# Altium schematic sheet Célula 1.SchDoc
size A
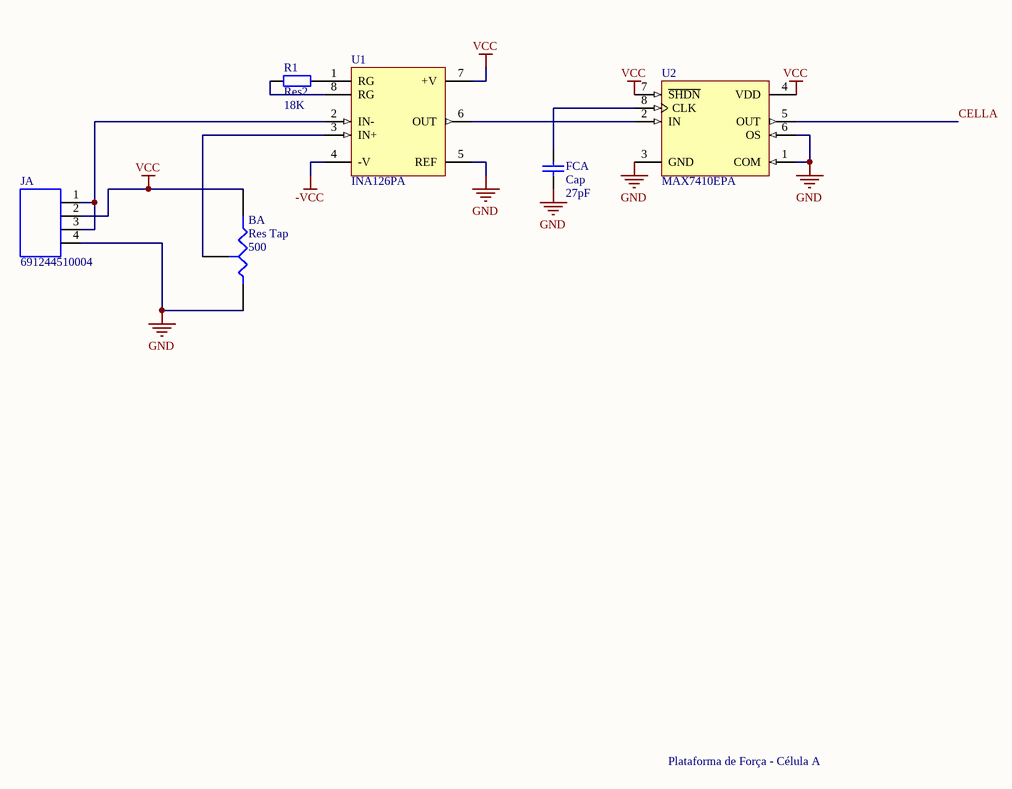
[diagram p0: Célula 1.SchDoc]

## Parts
BA  Res Tap  value 500  [TSR3006]
FCA  Cap  value 27pF  [RAD-0.3]
JA  691244510004  [691244510004]
R1  Res2  value 18K  [AXIAL-0.4]
U1  INA126PA  [006E]
U2  MAX7410EPA  [PA8]

## Nets
-VCC: U1.4(-V)
GND: BA.1(A) FCA.1 JA.4 U1.5(REF) U2.1(COM) U2.3(GND) U2.6(OS)
VCC: BA.2(B) JA.2 U1.7(+V) U2.4(VDD) U2.7(~{SHDN})
CELLA: U2.5(OUT)
NetBA_3: BA.3(TAP) U1.3(IN+)
NetFCA_2: FCA.2 U2.8(CLK)
NetJA_1: JA.1 JA.3 U1.2(IN-)
NetR1_1: R1.1 U1.8(RG)
NetR1_2: R1.2 U1.1(RG)
NetU1_6: U1.6(OUT) U2.2(IN)

## Notes on the sheet
- Plataforma de Força - Célula A

## Library data of the parts
BA = Res Tap: Tapped Resistor; Sim Note: Enter the Resistance value and the set point into parameter fields.; Set Position: 0.5; Published: 24-Mar-1999; LatestRevisionDate: 17-Jul-2002; LatestRevisionNote: Re-released for DXP Platform.; PackageReference: VR3; Publisher: Altium Limited; PackageDescription: Variable Resistor, Thru-Hole; 3 Leads
FCA = Cap: Capacitor; Published: 8-Jun-2000; LatestRevisionDate: 17-Jul-2002; LatestRevisionNote: Re-released for DXP Platform.; PackageReference: RAD-0.3; Publisher: Altium Limited; PackageDescription: Radial Cap, Thru-Hole; 2 Leads; 0.3 in Pin Spacing
JA = 691244510004: WR-TBL Horizontal Cable Entry With Rising Cage Clamp,Serie 2445 - 5.08 mm; Manufacturer: Wurth Elektronik; ComponentLink1 Description: Manufacturer; ComponentLink2 Description: Datasheet; ComponentLink1URL: http://www.we-online.de; ComponentLink2URL: http://katalog.we-online.de/em/datasheet/6912445100XX.pdf; Created by: Baojun Chen; Created Date: 15.Sep.2015; partNo: 691244510004
R1 = Res2: Resistor; Published: 8-Jun-2000; LatestRevisionDate: 17-Jul-2002; LatestRevisionNote: Re-released for DXP Platform.; PackageReference: AXIAL-0.4; Publisher: Altium Limited; PackageDescription: Axial Device, Thru-Hole; 2 Leads; 0.4 in Pin Spacing
U1 = INA126PA: Precision, Low-Power Instrumentation Amplifiers; Published: 8-Jun-2000; LatestRevisionDate: 06-Jun-2005; LatestRevisionNote: Stylized 3D Model Added.; DatasheetVersion: Oct-1996; PackageVersion: revE; PackageReference: 006E; Publisher: Altium Limited; PackageDescription: DIP; 8 Leads; Row Spacing 7.62 mm; Pitch 2.54 mm; ComponentLink1Description: Manufacturer Link; ComponentLink1URL: http://www.ti.com/; ComponentLink2Description: Datasheet; ComponentLink2URL: http://www-s.ti.com/sc/ds/INA128.pdf
U2 = MAX7410EPA: 5th-Order, Lowpass, Switched-Capacitor Filter; Published: 16-Jan-2001; LatestRevisionDate: 29-May-2009; LatestRevisionNote: Component Body Added.; DatasheetVersion: Sep-1998; PackageVersion: RevB, 21-0043; PackageReference: PA8; Publisher: Altium Limited; PackageDescription: DIP, 8-Pin, Row Spacing 7.62 mm, Pitch 2.54 mm; Code_JEDEC: MS-001-AB; ComponentLink1Description: Manufacturer Link; ComponentLink1URL: http://www.maxim-ic.com/; ComponentLink2Description: Datasheet; ComponentLink2URL: http://pdfserv.maxim-ic.com/en/ds/MAX7409-MAX7414.pdf